# Altium schematic sheet Slave_Micro.SchDoc
size A
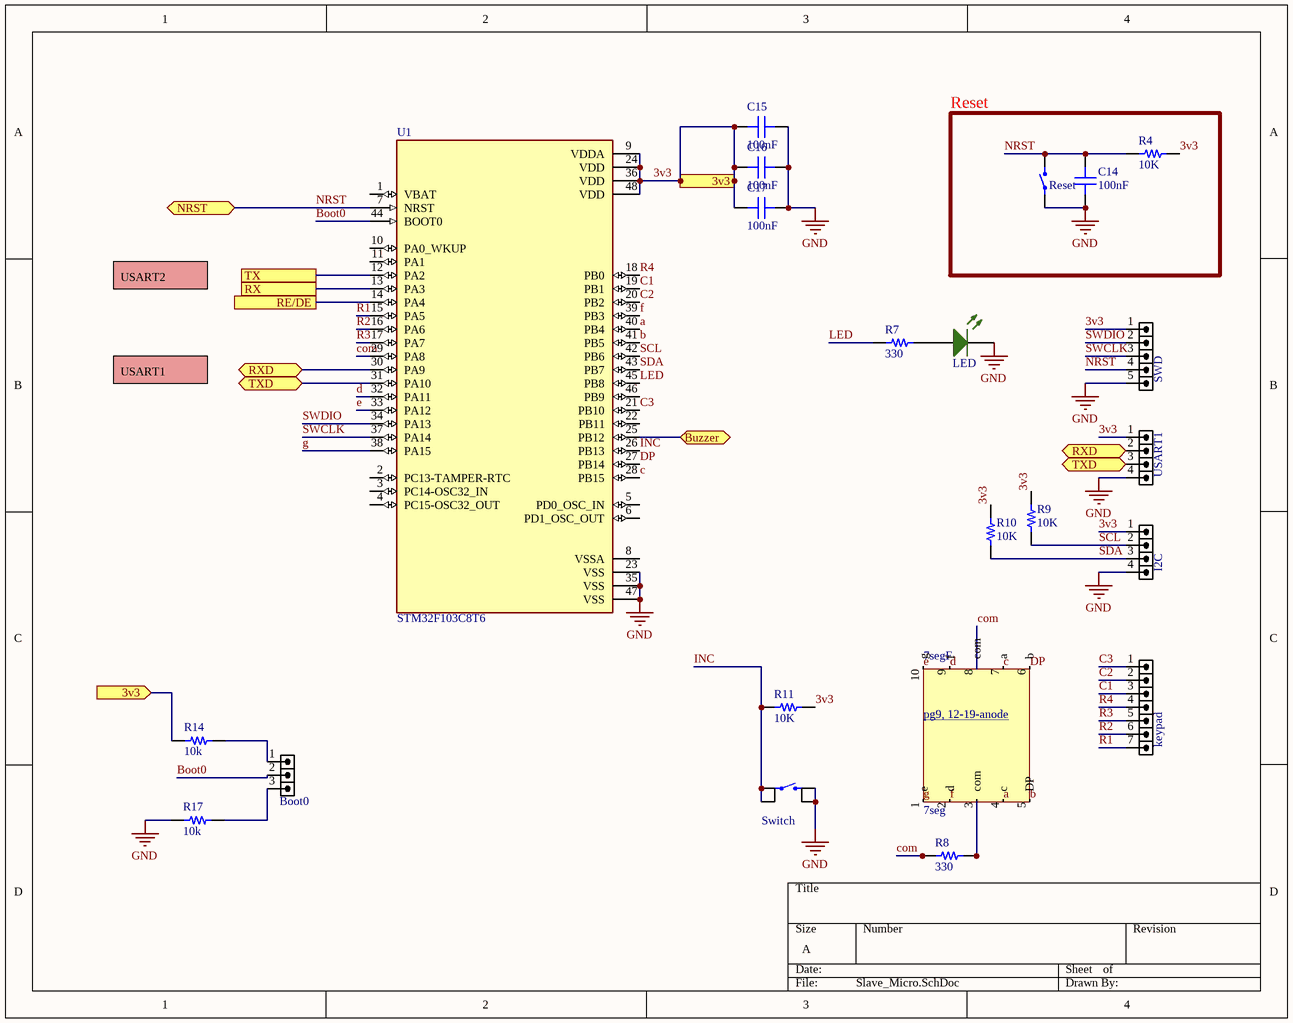
[diagram p0: Slave_Micro.SchDoc]

## Parts
7seg  7seg  [7seg 12x19]  (part F of 6)
Boot0  HDRM3  [HDR_1X3]  (value not drawn)
C14  100nF  [CAP 0805_2012]
C15  100nF  [CAP 0805_2012]
C16  100nF  [CAP 0805_2012]
C17  100nF  [CAP 0805_2012]
I2C  HDR1X4  [HDR_1X4]  (value not drawn)
keypad  HDR1X7  [HDR_1X7]  (value not drawn)
LED  LED SMD 0805 GREEN  [LED_0805_GREEN]  (value not drawn)
R4  10K  [RES 0805_2012]
R7  330  [RES 0805_2012]
R8  330  [RES 0805_2012]
R9  10K  [RES 0805_2012]
R10  10K  [RES 0805_2012]
R11  10K  [RES 0805_2012]
R14  10k  [RES 0805_2012]
R17  10k  [RES 0805_2012]
Reset  Tactile 2PIN 6X3.5mm H4.57mm (SMD)  [SWPBS_SPST_6X3X5]  (value not drawn)
SWD  HDR1X5  [HDR_1X5]  (value not drawn)
Switch  Tactile 4PIN 6X6mm H5mm (THD)  [SWPBT_SPDT_6X6X5SKHH]  (value not drawn)
U1  STM32F103C8T6  [QFP50P900X900X160-48N]
USART1  HDR1X4  [HDR_1X4]  (value not drawn)

## Blocks framed on the sheet
Reset: C14 R4 Reset

## Ports
3v3 (in), Buzzer (bidir), NRST (bidir), RE/DE, RX, RXD (bidir), TX, TXD (bidir)

## Nets
GND: C14.1 C15.1 C16.1 C17.1 I2C.4 LED.2(K) R17.1 Reset.1 SWD.5 Switch.2 Switch.3 U1.23(VSS) U1.35(VSS) U1.47(VSS) USART1.4
3v3: C15.2 C16.2 C17.2 I2C.1 R4.2 R9.2 R10.2 R11.2 R14.1 SWD.1 U1.9(VDDA) U1.24(VDD) U1.36(VDD) U1.48(VDD) USART1.1 ; port 3v3
a: 7seg.4(c) U1.40(PB4)
b: 7seg.5(DP) U1.41(PB5)
Boot0: Boot0.2 U1.44(BOOT0)
Buzzer: U1.25(PB12) ; port Buzzer
c: 7seg.7(a) U1.28(PB15)
C1: keypad.3 U1.19(PB1)
C2: keypad.2 U1.20(PB2)
C3: keypad.1 U1.21(PB10)
com: 7seg.8(com) R8.1 U1.29(PA8)
d: 7seg.9(f) U1.32(PA11)
DP: 7seg.6(b) U1.27(PB14)
e: 7seg.10(g) U1.33(PA12)
f: 7seg.2(d) U1.39(PB3)
g: 7seg.1(e) U1.38(PA15)
INC: R11.1 Switch.1 Switch.4 U1.26(PB13)
LED: R7.1 U1.45(PB8)
NRST: C14.2 R4.1 Reset.2 SWD.4 U1.7(NRST) ; port NRST
R1: keypad.7 U1.15(PA5)
R2: keypad.6 U1.16(PA6)
R3: keypad.5 U1.17(PA7)
R4: keypad.4 U1.18(PB0)
RE/DE: U1.14(PA4) ; port RE/DE
RX: U1.13(PA3) ; port RX
RXD: U1.30(PA9) USART1.2 ; port RXD
SCL: I2C.2 R9.1 U1.42(PB6)
SDA: I2C.3 R10.1 U1.43(PB7)
SWCLK: SWD.3 U1.37(PA14)
SWDIO: SWD.2 U1.34(PA13)
TX: U1.12(PA2) ; port TX
TXD: U1.31(PA10) USART1.3 ; port TXD
Net7seg_3: 7seg.3(com) R8.2
NetBoot0_1: Boot0.1 R14.2
NetBoot0_3: Boot0.3 R17.2
NetLED_1: LED.1(A) R7.2

Not connected (* = marked no-connect by the designer): U1 1(VBAT) 2(PC13-TAMPER-RTC) 3(PC14-OSC32_IN) 4(PC15-OSC32_OUT) 5(PD0_OSC_IN) 6(PD1_OSC_OUT) 8(VSSA) 10(PA0_WKUP) 11(PA1) 22(PB11) 46(PB9)

## Notes on the sheet
- USART2
- USART1
- (in symbol 7seg, part F) pg9, 12-19-anode

## Library data of the parts
7seg = 7seg: file:///C:/Users/Tamana/Downloads/7SEG-12-19mm-GREEN-ANOD.pdf
Boot0 = HDR_1X3: CONN, HEADER, Male, pitch: 2.54mm, 3POS; VALUE: HDRM3
C14-C17 = Cap 0805: SMT Capacitor; VALUE: 100nF
I2C USART1 = HDR_1X4: CONN, HEADER, Male, pitch: 2.54mm, 4POS; VALUE: HDRM4
keypad = HDR_1X7: CONN, HEADER, Male, pitch: 2.54mm, 7POS; VALUE: HDRM7
R4 R7-R11 R14 R17 = Res 0805: SMT Resistor; VALUE: 1K
Reset = Tactile 2PIN 6X3.5mm H4.57mm (SMD): Tactile Switch SPST-NO Top Actuated Surface Mount; PartNumber: FSMSMTR-ND
SWD = HDR_1X5: CONN, HEADER, Male, pitch: 2.54mm, 5POS; VALUE: HDRM5
Switch = Tactile 4PIN 6X6mm H5mm (THD): Tactile Switch SPST-NO Top Actuated Surface Mount; PartNumber: PTS645SH50SMTR92 LFS
U1 = STM32F103C8T6: ARM® Cortex®-M3 STM32F1 Microcontroller IC 32-Bit 72MHz 64KB (64K x 8) FLASH 48-LQFP (7x7); MF: STMicroelectronics; SnapEDA_Link: https://www.snapeda.com/parts/STM32F103C8T6/STMicroelectronics/view-part/?ref=snap; Package: LQFP-48 STMicroelectronics; Value: *; MP: STM32F103C8T6; Check_prices: https://www.snapeda.com/parts/STM32F103C8T6/STMicroelectronics/view-part/?ref=eda